# EAGLE design P08R60 (EAGLE 9.3.0)

## Sheet 1 of 2
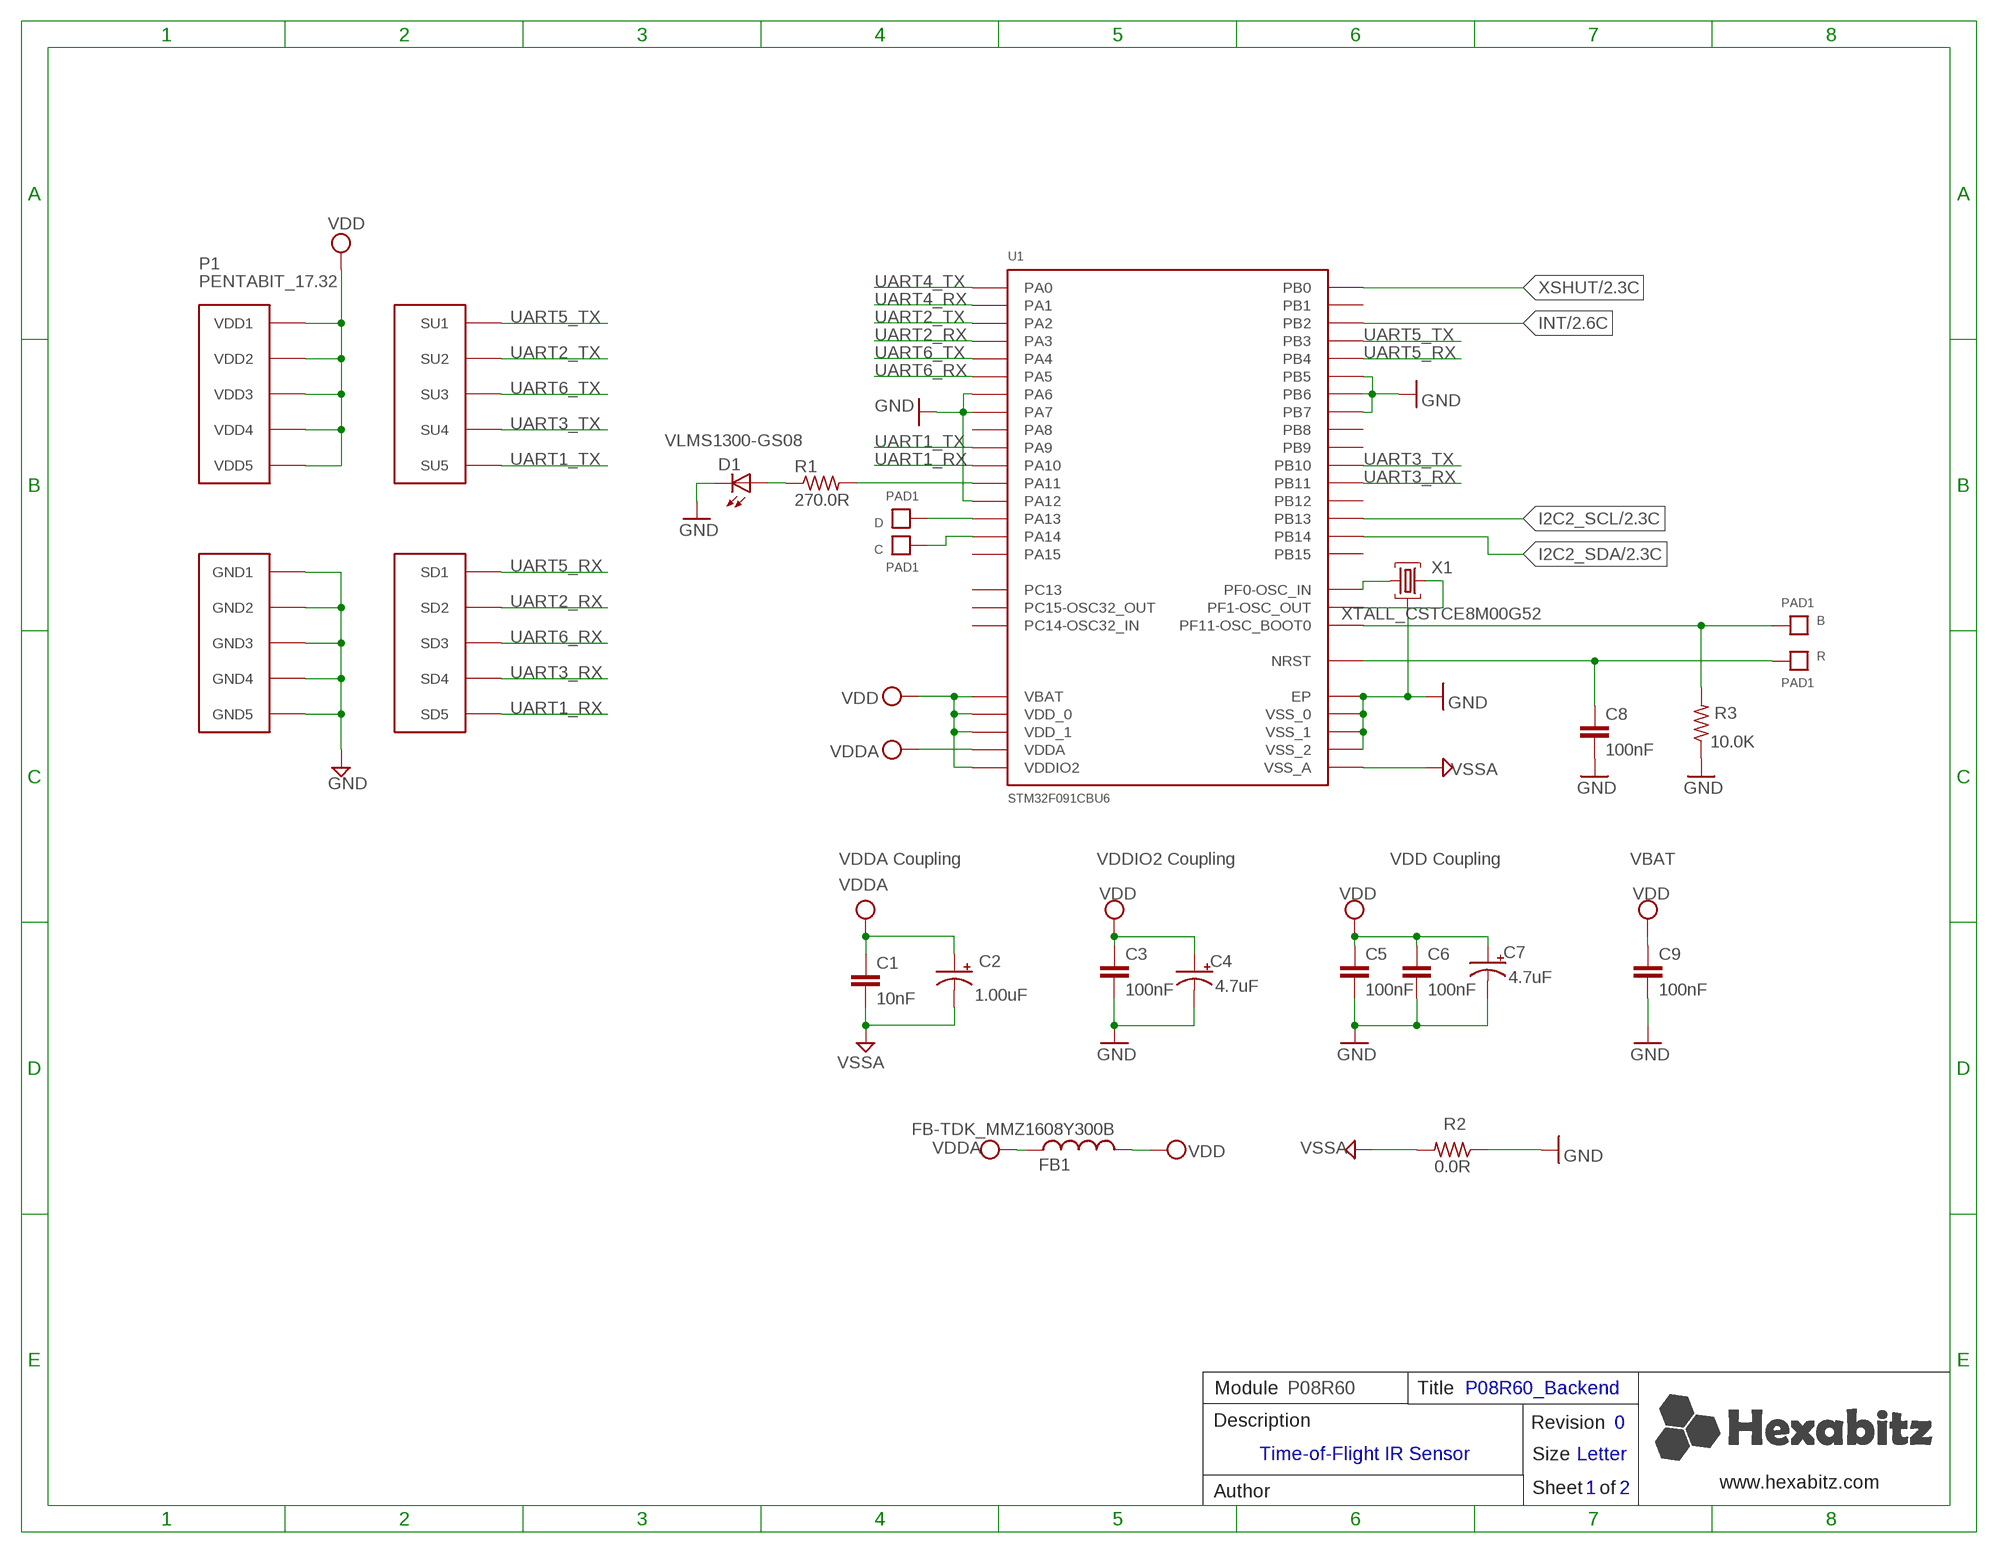
[diagram p0: schematic, sheet 1]

### Parts
B  PAD1  [PAD1]
C  PAD1  [PAD1]
C1  10nF  C-0603  [C-0603]
C2  1.00uF  C-0805-POL  [C-0805-POL]
C3  100nF  C-0603  [C-0603]
C4  4.7uF  C-0805-POL  [C-0805-POL]
C5  100nF  C-0603  [C-0603]
C6  100nF  C-0603  [C-0603]
C7  4.7uF  C-0805-POL  [C-0805-POL]
C8  100nF  C-0603  [C-0603]
C9  100nF  C-0603  [C-0603]
D  PAD1  [PAD1]
D1  VLMS1300-GS08  [VLMS1300-GS08]
FB1  FB-TDK_MMZ1608Y300B  [FB-TDK_MMZ1608Y300B]
P1  PENTABIT_17.32  [PENTABIT_17.32]
R  PAD1  [PAD1]
R1  270.0R  R-0603  [R-0603]
R2  0.0R  R-0603  [R-0603]
R3  10.0K  R-0603  [R-0603]
U1  STM32F091CBU6  [STM32F091CBU6]
X1  XTALL_CSTCE8M00G52  [XTALL_CSTCE8M00G52]

### Nets
B1: B.P$1 B.P$2 R3.2 U1.P$44(PF11-OSC_BOOT0)
GND: C3.2 C4.2(-) C5.2 C6.2 C7.2(-) C8.2 C9.2 D1.C P1.PAD_PD6(GND1) P1.PAD_PD7(GND2) P1.PAD_PD8(GND3) P1.PAD_PD9(GND4) P1.PAD_PD10(GND5) R2.1 R3.1 U1.EP U1.P$16(PA6) U1.P$17(PA7) U1.P$23(VSS_0) U1.P$33(PA12) U1.P$35(VSS_1) U1.P$41(PB5) U1.P$42(PB6) U1.P$43(PB7) U1.P$47(VSS_2) X1.P$2 ; also sheet 2
I2C2_SCL: U1.P$26(PB13) ; also sheet 2
I2C2_SDA: U1.P$27(PB14) ; also sheet 2
INT: U1.P$20(PB2) ; also sheet 2
N$3: R1.2 U1.P$32(PA11)
N$4: D1.A R1.1
N$5: U1.P$5(PF0-OSC_IN) X1.P$1
N$6: U1.P$6(PF1-OSC_OUT) X1.P$3
N$7: D.P$1 D.P$2 U1.P$34(PA13)
N$9: C.P$1 C.P$2 U1.P$37(PA14)
R1: C8.1 R.P$1 R.P$2 U1.P$7(NRST)
UART1_RX: P1.PAD_PD5(SD5) U1.P$31(PA10)
UART1_TX: P1.PAD_PU5(SU5) U1.P$30(PA9)
UART2_RX: P1.PAD_PD2(SD2) U1.P$13(PA3)
UART2_TX: P1.PAD_PU2(SU2) U1.P$12(PA2)
UART3_RX: P1.PAD_PD4(SD4) U1.P$22(PB11)
UART3_TX: P1.PAD_PU4(SU4) U1.P$21(PB10)
UART4_RX: U1.P$11(PA1)
UART4_TX: U1.P$10(PA0)
UART5_RX: P1.PAD_PD1(SD1) U1.P$40(PB4)
UART5_TX: P1.PAD_PU1(SU1) U1.P$39(PB3)
UART6_RX: P1.PAD_PD3(SD3) U1.P$15(PA5)
UART6_TX: P1.PAD_PU3(SU3) U1.P$14(PA4)
VDD: C3.1 C4.1(+) C5.1 C6.1 C7.1(+) C9.1 FB1.2 P1.PAD_PU6(VDD1) P1.PAD_PU7(VDD2) P1.PAD_PU8(VDD3) P1.PAD_PU9(VDD4) P1.PAD_PU10(VDD5) U1.P$1(VBAT) U1.P$24(VDD_0) U1.P$36(VDDIO2) U1.P$48(VDD_1) ; also sheet 2
VDDA: C1.1 C2.1(+) FB1.1 U1.P$9(VDDA)
VSSA: C1.2 C2.2(-) R2.2 U1.P$8(VSS_A)
XSHUT: U1.P$18(PB0) ; also sheet 2
Unconnected: U1.P$2(PC13) U1.P$3(PC14-OSC32_IN) U1.P$4(PC15-OSC32_OUT) U1.P$19(PB1) U1.P$25(PB12) U1.P$28(PB15) U1.P$29(PA8) U1.P$38(PA15) U1.P$45(PB8) U1.P$46(PB9)

### Notes on the sheet
- VDDA Coupling | VDDIO2 Coupling | VDD Coupling | VBAT
- Module | P08R60 | Title | P08R60_Backend
- Description | Revision | 0
- Time-of-Flight IR Sensor
- Size | Letter
- www.hexabitz.com
- Author | Sheet   of | 1 | 2
- C:/Users/Admin/Desktop/logodraft.bmp

## Sheet 2 of 2
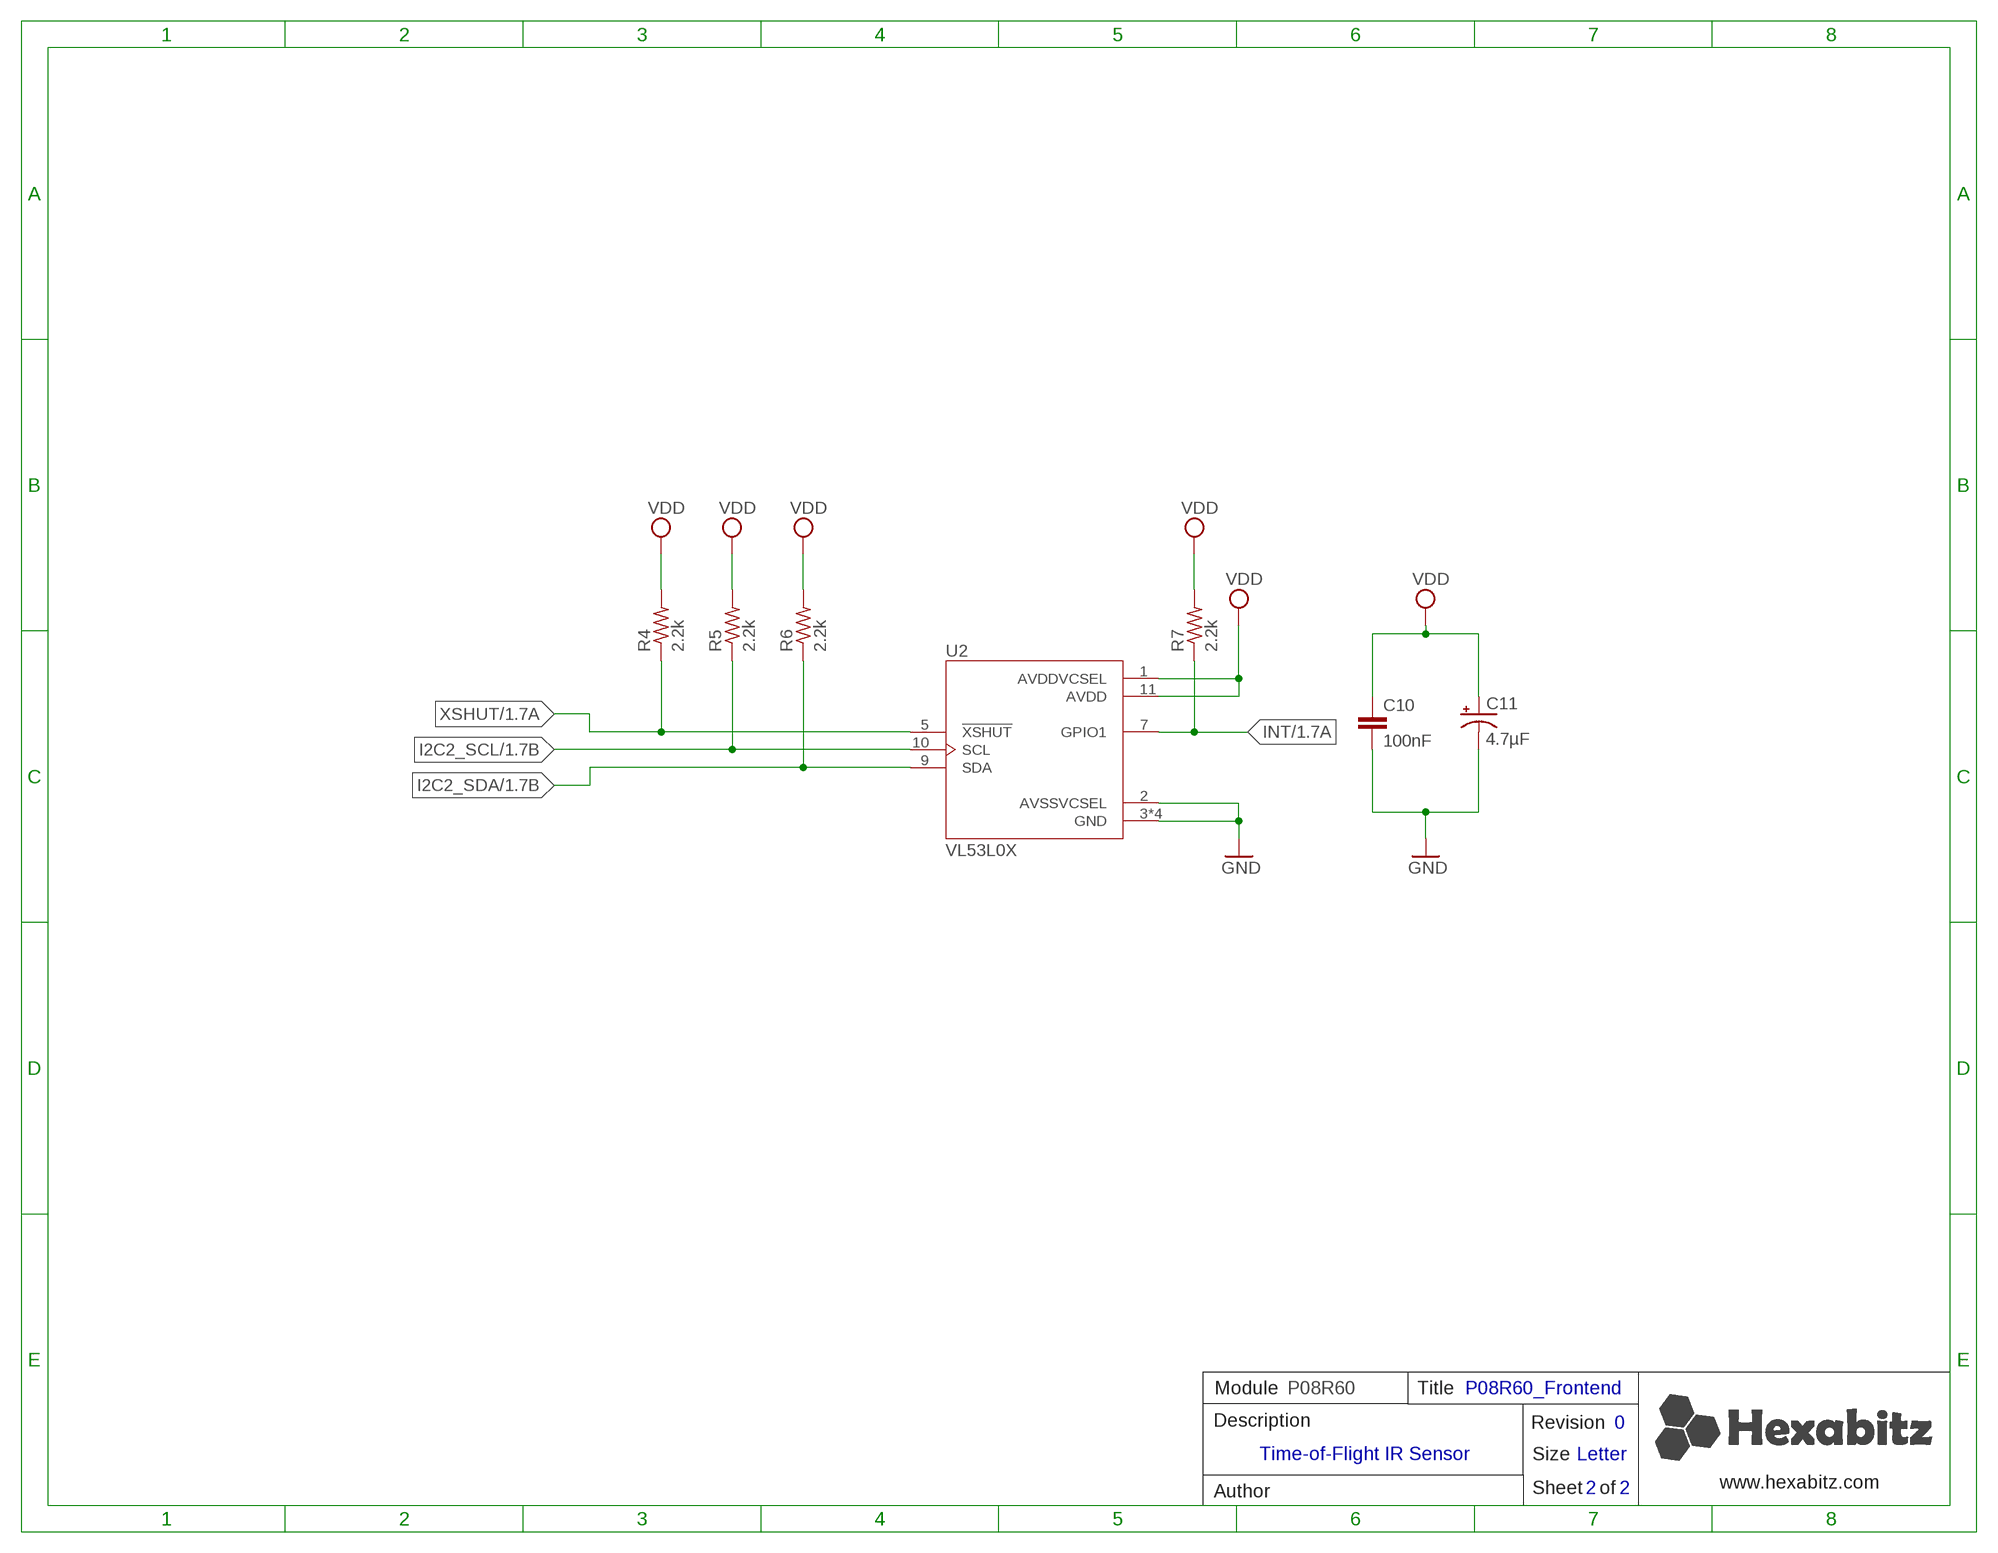
[diagram p1: schematic, sheet 2]

### Parts
C10  100nF  C-0603  [C-0603]
C11  4.7uF  C-0805  [C-0805]
R4  2.2k  R-0603  [R-0603]
R5  2.2k  R-0603  [R-0603]
R6  2.2k  R-0603  [R-0603]
R7  2.2k  R-0603  [R-0603]
U2  VL53L0X  [SENSOR_VL53L0X]

### Nets
GND: C10.2 C11.2(-) U2.2(AVSSVCSEL) U2.3(GND) U2.4(GND) U2.6(GND) U2.12(GND) ; also sheet 1
I2C2_SCL: R5.1 U2.10(SCL) ; also sheet 1
I2C2_SDA: R6.1 U2.9(SDA) ; also sheet 1
INT: R7.1 U2.7(GPIO1) ; also sheet 1
VDD: C10.1 C11.1(+) R4.2 R5.2 R6.2 R7.2 U2.1(AVDDVCSEL) U2.11(AVDD) ; also sheet 1
XSHUT: R4.1 U2.5(!XSHUT) ; also sheet 1

### Notes on the sheet
- Module | P08R60 | Title | P08R60_Frontend
- Description | Revision | 0
- Time-of-Flight IR Sensor
- Size | Letter
- www.hexabitz.com
- Author | Sheet   of | 2 | 2

## Library data of the parts
B C D R = Hexabitz:PAD1
C1 = Hexabitz:C-0603: CAP CER 10% X7R 0603; CAPACITANCE: 10nF; MFN: KEMET; MPN: C0603C103K5RACTU; OCTOPART_URL: https://octopart.com/c0603c103k5ractu-kemet-133094?r=sp&s=R_iPBxLnSmGqhkU2rIMFpg; TOLERANCE: 10%; VOLTAGE_RATING: 50V
C2 = Hexabitz:C-0805-POL: Cap Tant Solid SMD 2012; CAPACITANCE: 1.00uF; MFN: Yageo; MPN: CC0805KKX7R7BB105; OCTOPART_URL: https://octopart.com/cc0805kkx7r7bb105-yageo-8376555?r=sp&s=YKl1wwtkROau_X5nniH2ig; TOLERANCE: 10%; VOLTAGE_RATING: 16V
C3 C6 C8 = Hexabitz:C-0603: CAP CER 10% X7R 0603; CAPACITANCE: 100nF; MFN: KEMET; MPN: C0603C104K8RACTU; OCTOPART_URL: https://octopart.com/c0603c104k8ractu-kemet-145075?r=sp&s=9bS9ASSwSEqMCE9KBEQZ0g; TOLERANCE: 10%; VOLTAGE_RATING: 10V
C4 C7 = Hexabitz:C-0805-POL: Cap Tant Solid SMD 2012; CAPACITANCE: 4.7uF; MFN: Murata; MPN: GRM21BC81E475KA12L; OCTOPART_URL: https://octopart.com/grm21bc81e475ka12l-murata-10331911?r=sp&s=RY3qZSD8T6mG6TC9CHI5qQ; TOLERANCE: 10%; VOLTAGE_RATING: 25V
C5 = Hexabitz:C-0603: CAP CER 10% X7R 0603; CAPACITANCE: 100nF; MFN: KEMET; MPN: C0603C104K8RACTU; OCTOPART_URL: https://octopart.com/c0603c104k8ractu-kemet-145075?r=sp&s=9bS9ASSwSEqMCE9KBEQZ0g; TOLERANCE: 10%; VOLTAGE_RATING: 10
C9 = Hexabitz:C-0603: CAP CER 10% X7R 0603; CAPACITANCE: 100nF; MFN: KEMET; MPN: C0603C104K8RACTU; OCTOPART_URL: https://octopart.com/c0603c104k8ractu-kemet-145075?r=sp&s=9bS9ASSwSEqMCE9KBEQZ0g; TOLERANCE: 10V; VOLTAGE_RATING: 10%
C10 = Hexabitz:C-0603: CAP CER 10% X7R 0603; CAPACITANCE: 100 nF; MFN: KEMET; MPN: C0603C104K8RACTU; OCTOPART_URL: https://octopart.com/0603yc104k4t2a-avx+interconnect+%2F+elco-8120651; TOLERANCE: ±10%; VOLTAGE_RATING: 16.0 V
C11 = Hexabitz:C-0805: Cap Tant Solid SMD 2012; CAPACITANCE: 4.7µF; MFN: Murata; MPN: GRM21BC81E475KA12L; OCTOPART_URL: https://octopart.com/grm21bc81e475ka12l-murata-10331911?r=sp&s=RY3qZSD8T6mG6TC9CHI5qQ; TOLERANCE: 10%; VOLTAGE_RATING: 25V
D1 = Hexabitz:VLMS1300-GS08: Red 0603 130° Clear 54 mcd 2 V Surface Mount ChipLED ; Octopart Url : http://octopart.com/vlms1300-gs08-vishay-21709201; MFN: Vishay; MPN: VLMS1300-GS08; OCTOPART_URL: https://octopart.com/vlms1300-gs08-vishay-21709201?r=sp&s=_gcP4_q8T1SC6PJQPTQ9yA
FB1 = Hexabitz:FB-TDK_MMZ1608Y300B: Ferrite Beads Multi-Layer 30Ohm 25% 100MHz 1.5A 50mOhm DCR 0603; MFN: TDK; MPN: MMZ1608Y300B; OCTOPART_URL: https://octopart.com/mmz1608y300b-tdk-368280?r=sp&s=cd9_2ZEqQ9q9UNBuQgHAiA
P1 = hexabitz_connectors:PENTABIT_?: Hexabitz Pentagon Module Connector Pentagon side length = 17.32mm.
R1 = Hexabitz:R-0603: Thick Film Resistors - SMD 0603; MFN: Yageo; MPN: RC0603FR-07270RL; OCTOPART_URL: https://octopart.com/search?q=RC0603FR-07270RL&start=0; RESISTANCE: 270.0 Ohm; TOLERANCE: 1%
R2 = Hexabitz:R-0603: Thick Film Resistors - SMD 0603; MFN: Yageo; MPN: RC0603JR-070RL; OCTOPART_URL: https://octopart.com/rc0603jr-070rl-yageo-1241539?r=sp&s=X2NteqRjRNWrnx42Y0aliA; RESISTANCE: 0.0 Ohm
R3 = Hexabitz:R-0603: Thick Film Resistors - SMD 0603; MFN: Yageo; MPN: RC0603JR-0710KL; OCTOPART_URL: https://octopart.com/search?q=RC0603JR-0710KL&start=0; RESISTANCE: 10.0K Ohm; TOLERANCE: 5%
R4-R7 = Hexabitz:R-0603: Thick Film Resistors - SMD 0603; MFN: Vishay; MPN: CRCW06032K20FKEA; OCTOPART_URL: https://octopart.com/crcw06032k20fkea-vishay-40018987; RESISTANCE: 2.2 kΩ; TOLERANCE: ±1%
U1 = Hexabitz:STM32F091CBU6: Description : ARM-based 32-bit MCU, CAN, 12 timers, ADC, DAC & Comm. Interface, 2 to 3.6 V, -40 to 85 degC, 48-Pin UFQFPN, RoHS, Tray ;Parameter : Ciiva URL : https://ciiva.com/part/STM32F091CBU6-20240708, CiivaID : 20240708, Clock Speed : 48000000.0 Hz, Lifecycle Status : Active, Mounting Style : Surface Mount, Number of Pins : 48, Octopart Url : https://octopart.com/stm32f091cbu6-stmicroelectronics-51988677, OctopartID : 5f4f955c32ec8088, RAM Memory Size : 32768 B, REACH SVHC Compliance : No SVHC, RoHS : Compliant,; MFN: STMicroelectronics; MPN: STM32F091CBU6; OCTOPART_URL: https://octopart.com/stm32f091cbu6-stmicroelectronics-51988677?r=sp&s=bU6fpgsrTZOxHyt7jkfh3w
U2 = Hexabitz:VL53L0X: Time-of-Flight Ranging & Gesture Detection Sensor; MFN: STMicroelectronics; MPN: VL53L0CXV0DH/1; OCTOPART_URL: http://octopart.com/vl53l0cxv0dh%2F1-stmicroelectronics-71168165
X1 = Hexabitz:XTALL_CSTCE8M00G52: MURATA CSTCE8M00G52-R0 RESONATOR, SMD, 8MHZ ; Octopart Url : https://octopart.com/cstce8m00g52-r0-murata-7145559; MFN: Murata; MPN: CSTCE8M00G52Z-R0; OCTOPART_URL: https://octopart.com/cstce8m00g52z-r0-murata-17755941?r=sp&s=JDnNJnrHQhyS8Zk4ofFWXw

## Board
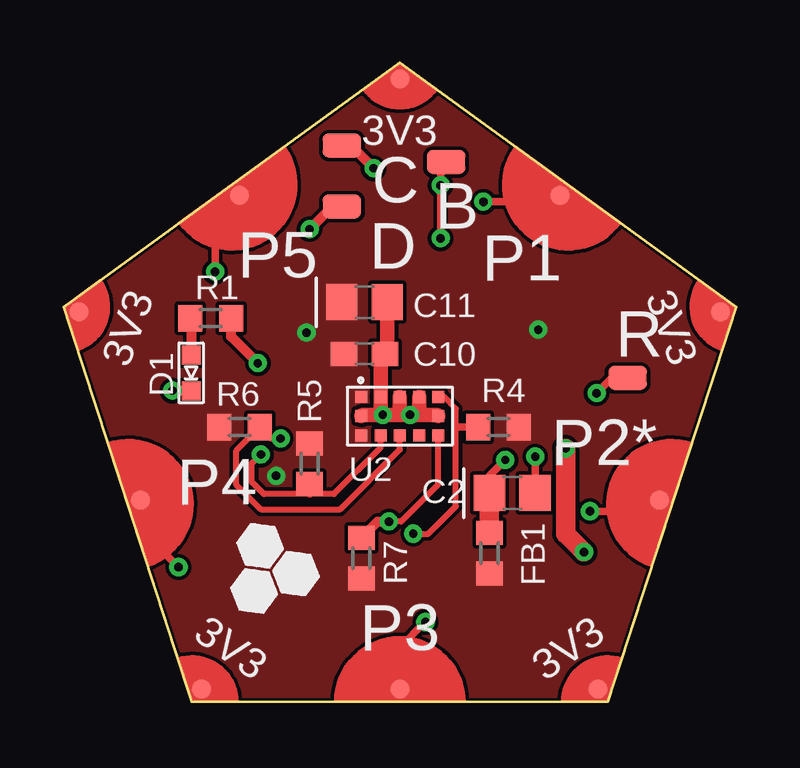
[diagram p2: board, top side]
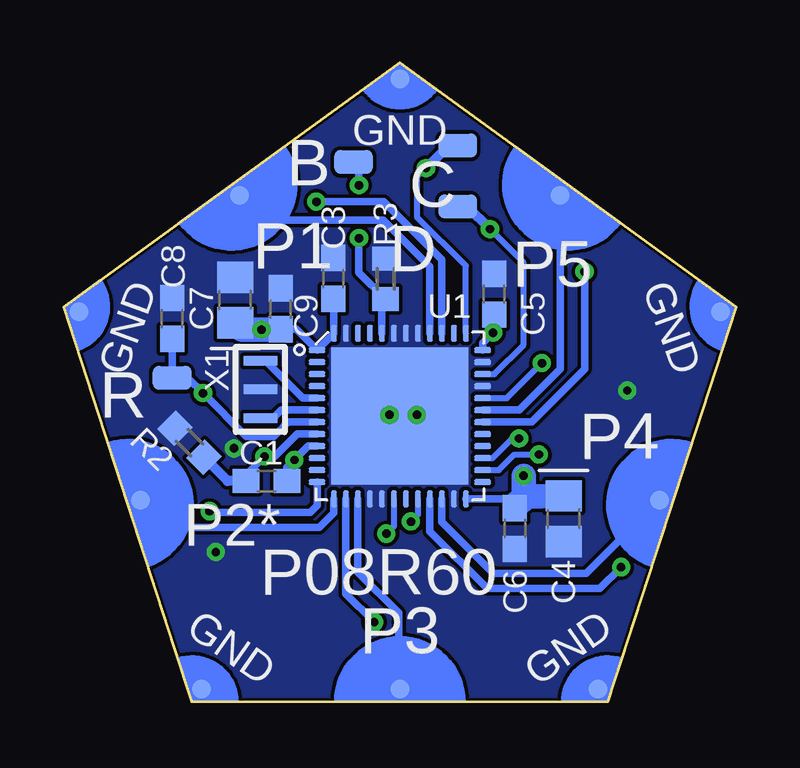
[diagram p3: board, bottom side, seen from below]

Size 28.02 x 26.65 mm. Coordinates in mm from the lower left corner, seen from the top.
Copper layers (1*16): Top 0.035mm / dielectric 1.5mm / Bottom 0.035mm
Design rules "2_layer": minimum track width 7mil, minimum drill 10mil, track to track 6mil, track to pad 6mil, pad to pad 6mil, via to via 6mil, smd to smd 0mil, copper to edge 1mil, drill to drill 8mil, minimum pad ring 10mil, minimum via ring 8mil, stop-mask expansion 2mil, vias tented up to drill 15mil, thermal gap 10mil

### Footprints (pad centres in the part's own frame; a part is rotated, then mirrored left to right if it is on the bottom)
PAD1 = smd 1.6 x 1: P$1 0,0 | smd 1.6 x 1 bottom: P$2 0,0
C-0603 = smd 1.1 x 1: 1 -0.85,0; 2 0.85,0
C-0805-POL = smd 1.3 x 1.5: 1 -0.95,0; 2 0.95,0
C-0805 = smd 1.3 x 1.5: 1 -0.95,0; 2 0.95,0
VLMS1300-GS08 = smd 0.8 x 0.8: A 0,0.75; C 0,-0.75
FB-TDK_MMZ1608Y300B = smd 1 x 1.1: 1 -0.85,0; 2 0.85,0
PENTABIT_17.32 = smd 0.8 x 0.8 bottom: PAD_PD1 6.68,9.2; PAD_PD2 10.81,-3.51; PAD_PD3 0,-11.37; PAD_PD4 -10.81,-3.51; PAD_PD5 -6.68,9.2; PAD_PD6 0,14.05; PAD_PD7 13.36,4.34; PAD_PD8 8.26,-11.37; PAD_PD9 -8.26,-11.37; PAD_PD10 -13.36,4.34 | smd 0.8 x 0.8: PAD_PU1 6.68,9.2; PAD_PU2 10.81,-3.51; PAD_PU3 0,-11.37; PAD_PU4 -10.81,-3.51; PAD_PU5 -6.68,9.2; PAD_PU6 0,14.05; PAD_PU7 13.36,4.34; PAD_PU8 8.26,-11.37; PAD_PU9 -8.26,-11.37; PAD_PU10 -13.36,4.34
R-0603 = smd 1 x 1.1: 1 -0.85,0; 2 0.85,0
STM32F091CBU6 = smd 5.7 x 5.7: EP 0,0 | smd 0.25 x 0.7: P$1 -2.75,-3.45; P$2 -2.25,-3.45; P$3 -1.75,-3.45; P$4 -1.25,-3.45; P$5 -0.75,-3.45; P$6 -0.25,-3.45; P$7 0.25,-3.45; P$8 0.75,-3.45; P$9 1.25,-3.45; P$10 1.75,-3.45; P$11 2.25,-3.45; P$12 2.75,-3.45; P$25 2.75,3.45; P$26 2.25,3.45; P$27 1.75,3.45; P$28 1.25,3.45; P$29 0.75,3.45; P$30 0.25,3.45; P$31 -0.25,3.45; P$32 -0.75,3.45; P$33 -1.25,3.45; P$34 -1.75,3.45; P$35 -2.25,3.45; P$36 -2.75,3.45 | smd 0.7 x 0.25: P$13 3.45,-2.75; P$14 3.45,-2.25; P$15 3.45,-1.75; P$16 3.45,-1.25; P$17 3.45,-0.75; P$18 3.45,-0.25; P$19 3.45,0.25; P$20 3.45,0.75; P$21 3.45,1.25; P$22 3.45,1.75; P$23 3.45,2.25; P$24 3.45,2.75; P$37 -3.45,2.75; P$38 -3.45,2.25; P$39 -3.45,1.75; P$40 -3.45,1.25; P$41 -3.45,0.75; P$42 -3.45,0.25; P$43 -3.45,-0.25; P$44 -3.45,-0.75; P$45 -3.45,-1.25; P$46 -3.45,-1.75; P$47 -3.45,-2.25; P$48 -3.45,-2.75
SENSOR_VL53L0X = smd 0.5 x 0.5: 1 -1.6,0.8; 2 -0.8,0.8; 3 0,0.8; 4 0.8,0.8; 5 1.6,0.8; 6 1.6,0; 7 1.6,-0.8; 8 0.8,-0.8; 9 0,-0.8; 10 -0.8,-0.8; 11 -1.6,-0.8; 12 -1.6,0
XTALL_CSTCE8M00G52 = smd 1.4 x 0.4: P$1 0,1.2; P$2 0,0; P$3 0,-1.2

### Placement (x,y rotation side)
B  15.94,22.51 0 top
C  11.6,23.2 0 top
C1  19.56,9.22 180 bottom
C2  18.69,8.72 0 top
C3  16.78,17.66 90 bottom
C4  7.18,7.64 270 bottom
C5  10.08,17 90 bottom
C6  9.21,7.23 270 bottom
C7  20.87,16.76 90 bottom
C8  23.49,15.99 90 bottom
C9  18.97,16.39 90 bottom
C10  12.54,14.51 0 top
C11  12.54,16.67 0 top
D  11.6,20.66 180 top
D1  5.32,13.72 0 top
FB1  17.75,6.21 270 top
P1  14.01,11.92 0 top
R  23.5,13.52 0 top
R1  6.13,16 0 top
R2  22.77,10.81 315 bottom
R3  14.6,17.65 270 bottom
R4  18.12,11.46 0 top
R5  10.25,9.94 90 top
R6  7.33,11.46 180 top
R7  12.41,6 270 top
U1  14.01,11.92 270 bottom
U2  14.01,11.92 0 top
X1  19.82,13.04 0 bottom

### Tracks (layer width: path | path; a pad name or v marks a point on that pad's centre or on a via)
B1  (via drill 0.35)
  Top 0.305: v15.71,19.34 v15.71,21.54 15.71,22.28 B.P$1
  Bottom 0.305: U1.P$44 14.76,16.64 R3.2 15.71,17.91 v15.71,19.34 | B.P$1 15.71,22.28 v15.71,21.54
GND  (via drill 0.35)
  Top 0.406: D1.C 4.55,12.97 v4.54,12.99
  Top 0.61: C11.2 13.49,14.61 C10.2 13.21,14.33 U2.2 13.21,12.06 v13.3,11.97 | U2.6 15.56,11.97 14.82,11.97 | 14.82,11.97 v14.44,11.97 14.06,11.97 | 14.06,11.97 v13.3,11.97 | U2.3 14.01,12.02 14.06,11.97 | U2.4 14.81,11.98 14.82,11.97 | v13.3,11.97 12.46,11.97 U2.12
  Top 0.813: v21.68,6.26 20.92,7.02 v20.92,10.57
  pour Bottom (isolate 0.102, no thermals): 14.01,26.65 28.02,16.47 22.67,0 5.35,0 0,16.47
I2C2_SCL  (via drill 0.35)
  Top 0.254: v8.22,10.32 7.84,9.94 7.84,9.18 8.35,8.67 10.25,8.67 11.27,8.67 13.21,10.61 U2.10
  Top 0.305: R5.1 10.25,8.67
  Bottom 0.254: U1.P$26 9.88,9.67 9.23,10.32 v8.22,10.32
I2C2_SDA  (via drill 0.35)
  Top 0.254: U2.9 14.01,10.52 11.52,8.03 8.22,8.03 7.2,9.05 7.2,10.49 R6.1 8.66,10.99 v9.04,10.99
  Bottom 0.254: U1.P$27 10.15,10.17 9.33,10.99 v9.04,10.99
INT  (via drill 0.35)
  Top 0.254: U2.7 15.61,9.07 14.06,7.53 v13.55,7.53
  Top 0.406: R7.1 13.08,7.53 v13.55,7.53
  Bottom 0.254: U1.P$20 13.26,7.82 v13.55,7.53
N$3  (via drill 0.35)
  Top 0.406: v8.09,14.13 6.98,15.24 R1.2
  Bottom 0.254: U1.P$32 9.55,12.67 v8.09,14.13
N$4
  Top 0.406: R1.1 5.32,15.97 D1.A
N$5
  Bottom 0.178: 19.63,14.24 X1.P$1
  Bottom 0.305: U1.P$5 18.06,12.67 19.63,14.24
N$6
  Bottom 0.305: U1.P$6 18.94,12.17 19.28,11.84 X1.P$3
N$7  (via drill 0.35)
  Top 0.406: v10.25,19.72 11.19,20.66 D.P$1
  Bottom 0.254: U1.P$34 10.08,13.67 8.85,14.89 8.85,18.32 v10.25,19.72
  Bottom 0.406: v10.25,19.72 11.19,20.66 D.P$1
N$9  (via drill 0.35)
  Top 0.406: v12.92,22.26 11.98,23.2 C.P$1
  Bottom 0.254: U1.P$37 11.26,18.19 13.3,20.23 13.3,21.88 v12.92,22.26
  Bottom 0.406: v12.92,22.26 11.98,23.2 C.P$1
R1  (via drill 0.35)
  Top 0.305: R.P$1 22.84,13.51 v22.21,12.88
  Bottom 0.305: U1.P$7 18.68,11.67 18.82,11.53 18.82,11.51 19,11.33 19.02,11.33 19.27,11.08 20.41,11.08 v22.21,12.88 22.84,13.51 R.P$1 23.49,13.53 C8.1
UART1_RX
  Bottom 0.305: U1.P$31 9.04,12.17 7.33,13.88 P1.PAD_PD5 | P1.PAD_PD5
UART1_TX  (via drill 0.35)
  Top 0.305: v6.31,17.94 6.31,20.1 P1.PAD_PU5
  Bottom 0.305: U1.P$30 8.52,11.67 6.31,13.88 v6.31,17.94
UART2_RX
  Bottom 0.305: U1.P$13 16.76,7.87 17.36,7.27 23.68,7.27 P1.PAD_PD2
UART2_TX  (via drill 0.35)
  Top 0.305: v21.93,7.95 24.36,7.95 P1.PAD_PU2
  Bottom 0.305: U1.P$12 17.46,8.19 17.74,7.91 21.89,7.91 v21.93,7.95
UART3_RX
  Bottom 0.305: U1.P$22 12.26,7.5 10.12,5.37 6.24,5.37 P1.PAD_PD4
UART3_TX  (via drill 0.35)
  Top 0.305: v4.79,5.62 3.78,6.63 P1.PAD_PU4
  Bottom 0.305: U1.P$21 12.76,7.11 10.38,4.73 5.68,4.73 v4.79,5.62
UART5_RX
  Bottom 0.305: U1.P$40 12.76,18.16 14.7,20.1 19.67,20.1 P1.PAD_PD1
UART5_TX  (via drill 0.35)
  Top 0.305: v17.49,20.86 20.43,20.86 P1.PAD_PU1
  Bottom 0.305: U1.P$39 12.26,18.44 14.68,20.86 v17.49,20.86
UART6_RX
  Bottom 0.305: U1.P$15 15.76,5.41 14.06,3.72 14.06,0.6 P1.PAD_PD3
UART6_TX  (via drill 0.35)
  Top 0.305: v15.08,3.33 14.01,2.27 P1.PAD_PU3
  Bottom 0.305: U1.P$14 16.26,4.52 v15.08,3.33
VDD  (via drill 0.35)
  Bottom 0.305: 8.96,8.47 U1.P$24 | C3.1 16.76,16.79 U1.P$48 U1.P$1 18.33,15.54 C9.1 | U1.P$36 10.56,14.96 v10.12,15.4 10.12,16.11 C5.1
  Bottom 1.016: C4.1 8.14,8.57 8.72,8.57 | 20.61,15.54 C7.1 20.59,15.53 v19.78,15.53 18.99,15.53 C9.1 | 8.72,8.57 C6.1 9.21,8.21 8.96,8.47 | v8.85,9.43 8.85,8.71 8.72,8.57
  pour Top (isolate 0.102, no thermals): 14.01,26.65 28.02,16.47 22.67,0 5.35,0 0,16.47
VDDA  (via drill 0.35)
  Top 0.305: v18.4,10.09 17.74,9.43 C2.1
  Top 0.813: C2.1 FB1.1
  Bottom 0.305: C1.1 18.71,9.78 v18.4,10.09 18.11,10.38 17.83,10.67 U1.P$9
VSSA  (via drill 0.35)
  Top 0.305: v19.65,10.23 v19.64,10.22 C2.2
  Bottom 0.305: U1.P$8 18.29,11.17 19.23,10.23 v19.65,10.23 20.41,9.47 C1.2
  Bottom 0.406: C1.2 21.18,9.22 R2.2
XSHUT  (via drill 0.35)
  Top 0.254: v14.57,7.02 15.2,7.02 16.35,8.16 16.35,11.46 16.35,12.22 15.85,12.72 U2.5
  Top 0.305: R4.1 16.35,11.46
  Bottom 0.254: U1.P$18 14.26,7.33 v14.57,7.02

### Text on the board
tPlace: 3V3 | P5 | P1 | 3V3 | 3V3 | P2* | P4 | P3 | 3V3 | 3V3
bPlace: GND | P1 | P5 | GND | GND | P4 | P2* | P08R60 | P3 | GND | GND
bNames: B | D | C | R